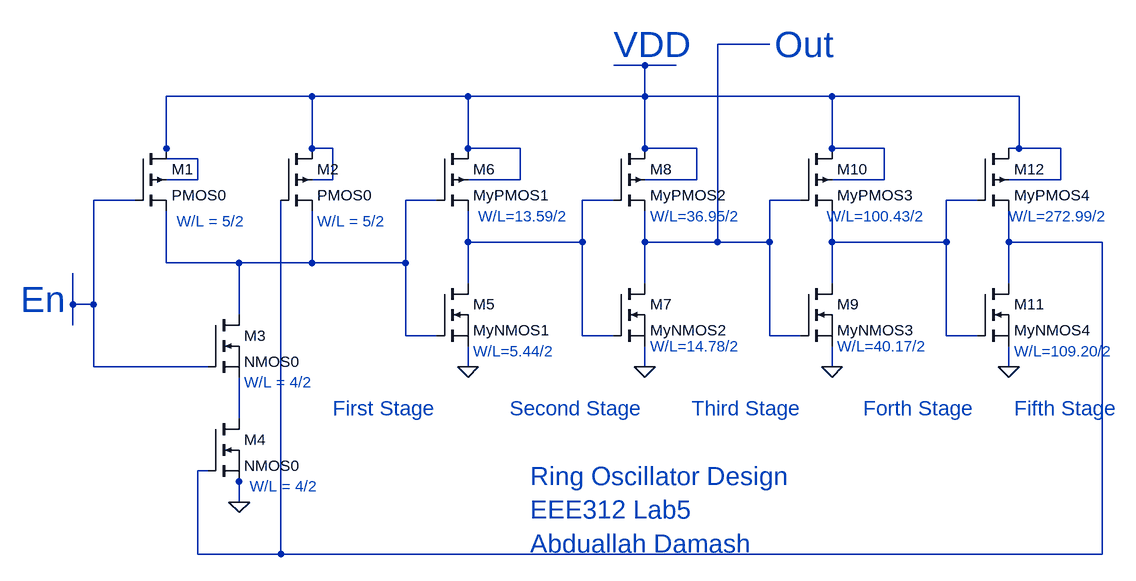
[diagram p0: schematic Ring Design For Report.asc]
Ring Design For Report.asc, the LTspice schematic file:
Version 4
SHEET 1 3084 1048
WIRE 1024 -96 944 -96
WIRE 832 -64 784 -64
WIRE 880 -64 832 -64
WIRE 320 -16 96 -16
WIRE 560 -16 320 -16
WIRE 832 -16 832 -64
WIRE 832 -16 560 -16
WIRE 1120 -16 832 -16
WIRE 1408 -16 1120 -16
WIRE 96 64 96 -16
WIRE 320 64 320 -16
WIRE 352 64 320 64
WIRE 560 64 560 -16
WIRE 640 64 560 64
WIRE 832 64 832 -16
WIRE 912 64 832 64
WIRE 1120 64 1120 -16
WIRE 1200 64 1120 64
WIRE 1408 64 1408 -16
WIRE 1408 64 1392 64
WIRE 1472 64 1408 64
WIRE 96 80 96 64
WIRE 144 80 96 80
WIRE 560 80 560 64
WIRE 144 112 144 80
WIRE 144 112 96 112
WIRE 352 112 352 64
WIRE 352 112 320 112
WIRE 640 112 640 64
WIRE 640 112 560 112
WIRE 912 112 912 64
WIRE 912 112 832 112
WIRE 1200 112 1200 64
WIRE 1200 112 1120 112
WIRE 1472 112 1472 64
WIRE 1472 112 1392 112
WIRE 48 144 -16 144
WIRE 512 144 464 144
WIRE 784 144 736 144
WIRE 1072 144 1024 144
WIRE 1344 144 1296 144
WIRE 560 208 560 160
WIRE 736 208 736 144
WIRE 736 208 560 208
WIRE 832 208 832 160
WIRE 944 208 944 -96
WIRE 944 208 832 208
WIRE 1024 208 1024 144
WIRE 1024 208 944 208
WIRE 1120 208 1120 160
WIRE 1296 208 1296 144
WIRE 1296 208 1120 208
WIRE 1392 208 1392 160
WIRE 1536 208 1392 208
WIRE 96 240 96 160
WIRE 208 240 96 240
WIRE 320 240 320 160
WIRE 320 240 208 240
WIRE 464 240 464 144
WIRE 464 240 320 240
WIRE 560 272 560 208
WIRE 832 272 832 208
WIRE 1120 272 1120 208
WIRE 1392 272 1392 208
WIRE -48 304 -48 256
WIRE -16 304 -16 144
WIRE -16 304 -48 304
WIRE 208 320 208 240
WIRE -48 336 -48 304
WIRE 464 352 464 240
WIRE 512 352 464 352
WIRE 736 352 736 208
WIRE 784 352 736 352
WIRE 1024 352 1024 208
WIRE 1072 352 1024 352
WIRE 1296 352 1296 208
WIRE 1344 352 1296 352
WIRE -16 400 -16 304
WIRE 160 400 -16 400
WIRE 560 400 560 368
WIRE 832 400 832 368
WIRE 1120 400 1120 368
WIRE 1392 400 1392 368
WIRE 208 480 208 416
WIRE 160 560 144 560
WIRE 208 576 208 560
WIRE 208 608 208 576
WIRE 144 688 144 560
WIRE 272 688 272 144
WIRE 272 688 144 688
WIRE 1536 688 1536 208
WIRE 1536 688 272 688
FLAG 208 608 0
FLAG 560 400 0
FLAG 832 400 0
FLAG 1120 400 0
FLAG 1392 400 0
SYMBOL pmos4 48 64 R0
SYMATTR InstName M1
SYMATTR Value PMOS0
SYMBOL pmos4 272 64 R0
SYMATTR InstName M2
SYMATTR Value PMOS0
SYMBOL nmos 160 320 R0
SYMATTR InstName M3
SYMATTR Value NMOS0
SYMBOL nmos 160 480 R0
SYMATTR InstName M4
SYMATTR Value NMOS0
SYMBOL nmos 512 272 R0
SYMATTR InstName M5
SYMATTR Value MyNMOS1
SYMBOL pmos4 512 64 R0
SYMATTR InstName M6
SYMATTR Value MyPMOS1
SYMBOL nmos 784 272 R0
SYMATTR InstName M7
SYMATTR Value MyNMOS2
SYMBOL pmos4 784 64 R0
SYMATTR InstName M8
SYMATTR Value MyPMOS2
SYMBOL nmos 1072 272 R0
SYMATTR InstName M9
SYMATTR Value MyNMOS3
SYMBOL pmos4 1072 64 R0
SYMATTR InstName M10
SYMATTR Value MyPMOS3
SYMBOL nmos 1344 272 R0
SYMATTR InstName M11
SYMATTR Value MyNMOS4
SYMBOL pmos4 1344 64 R0
SYMATTR InstName M12
SYMATTR Value MyPMOS4
TEXT 784 -96 Left 5 ;VDD
TEXT -128 296 Left 5 ;En
TEXT 1032 -96 Left 5 ;Out
TEXT 656 568 Left 4 ;Ring Oscillator Design\nEEE312 Lab5 \nAbduallah Damash
TEXT 352 464 Left 3 ;First Stage
TEXT 624 464 Left 3 ;Second Stage
TEXT 904 464 Left 3 ;Third Stage
TEXT 1168 464 Left 3 ;Forth Stage
TEXT 1400 464 Left 3 ;Fifth Stage
TEXT 328 176 Left 2 ;W/L = 5/2
TEXT 112 176 Left 2 ;W/L = 5/2
TEXT 216 424 Left 2 ;W/L = 4/2
TEXT 224 584 Left 2 ;W/L = 4/2
TEXT 576 168 Left 2 ;W/L=13.59/2
TEXT 840 168 Left 2 ;W/L=36.95/2
TEXT 1112 168 Left 2 ;W/L=100.43/2
TEXT 1392 168 Left 2 ;W/L=272.99/2
TEXT 568 376 Left 2 ;W/L=5.44/2
TEXT 840 368 Left 2 ;W/L=14.78/2
TEXT 1128 368 Left 2 ;W/L=40.17/2
TEXT 1400 376 Left 2 ;W/L=109.20/2

The netlist it stands for:
* Ring Design For Report.asc
M1 N002 N003 N004 N002 PMOS0
M2 N002 N007 N004 N002 PMOS0
M3 N004 N003 N008 N008 NMOS0
M4 N008 N007 0 0 NMOS0
M5 N005 N004 0 0 MyNMOS1
M6 N002 N004 N005 N002 MyPMOS1
M7 N001 N005 0 0 MyNMOS2
M8 N002 N005 N001 N002 MyPMOS2
M9 N006 N001 0 0 MyNMOS3
M10 N002 N001 N006 N002 MyPMOS3
M11 N007 N006 0 0 MyNMOS4
M12 N002 N006 N007 N002 MyPMOS4
.model NMOS NMOS
.model PMOS PMOS
.lib standard.mos
* VDD
* En
* Out
* Ring Oscillator Design
* EEE312 Lab5
* Abduallah Damash
* First Stage
* Second Stage
* Third Stage
* Forth Stage
* Fifth Stage
* W/L = 5/2
* W/L = 5/2
* W/L = 4/2
* W/L = 4/2
* W/L=13.59/2
* W/L=36.95/2
* W/L=100.43/2
* W/L=272.99/2
* W/L=5.44/2
* W/L=14.78/2
* W/L=40.17/2
* W/L=109.20/2
.backanno
.end